# EAGLE design APM-PX-Adapter (EAGLE 7.4.0)
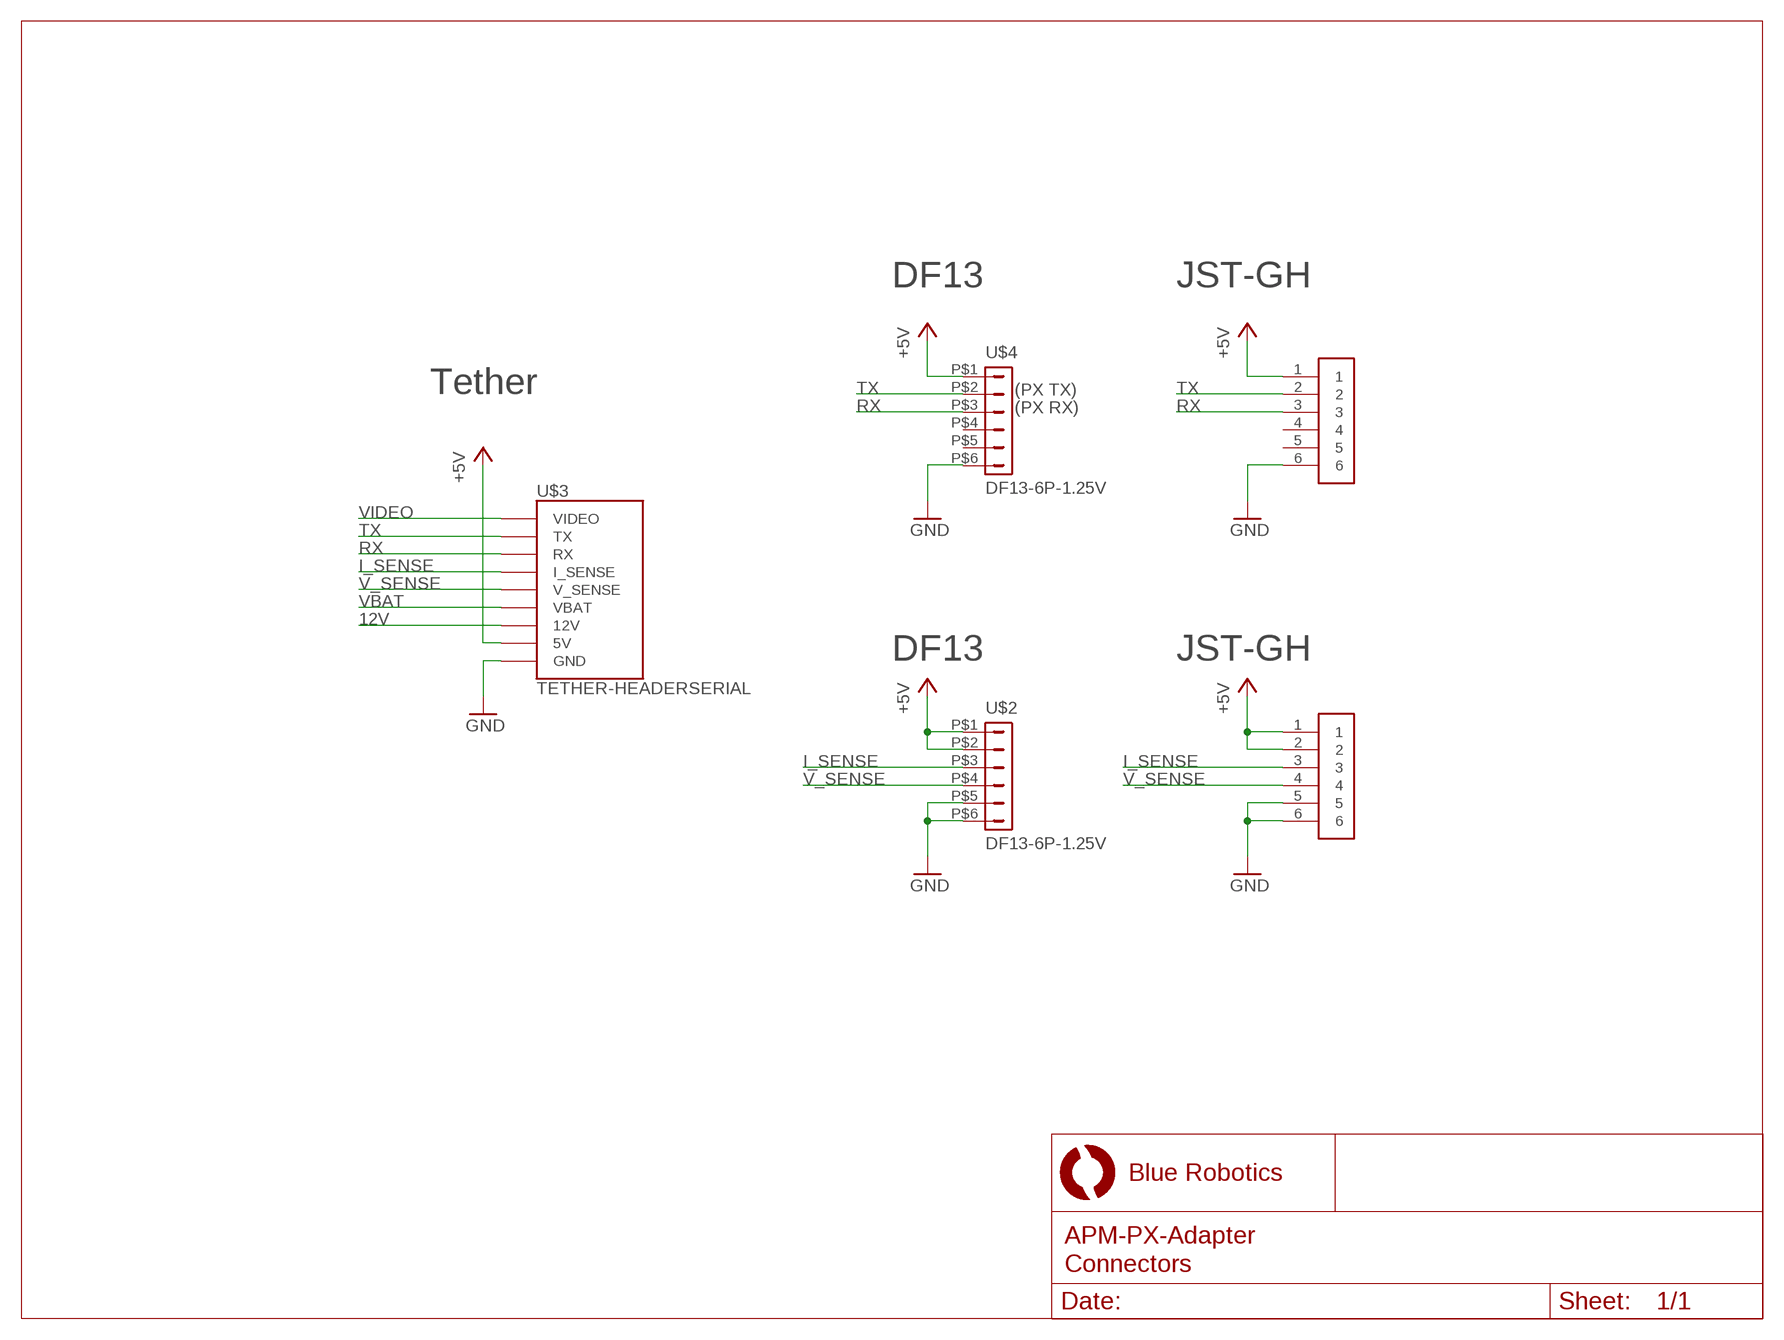
[diagram p0: schematic, sheet 1]

## Parts
U$1  JST-GH-6TOP-ENTRY  [JST-GH-TOP-6]
U$2  DF13-6P-1.25V  [DF13C-6P-1.25V]
U$3  TETHER-HEADERSERIAL  [TETHER-HEADER-2X7]
U$4  DF13-6P-1.25V  [DF13C-6P-1.25V]
U$5  JST-GH-6TOP-ENTRY  [JST-GH-TOP-6]

## Nets
12V: U$3.12V
+5V: U$1.1 U$2.P$1 U$2.P$2 U$3.5V U$4.P$1 U$5.1 U$5.2
GND: U$1.6 U$2.P$5 U$2.P$6 U$3.GND0(GND) U$3.GND1(GND) U$3.GND2(GND) U$4.P$6 U$5.5 U$5.6
I_SENSE: U$2.P$3 U$3.I_SENSE U$5.3
RX: U$1.3 U$3.RX U$4.P$3
TX: U$1.2 U$3.TX U$4.P$2
V_SENSE: U$2.P$4 U$3.V_SENSE U$5.4
VBAT: U$3.VBAT
VIDEO: U$3.VIDEO
Unconnected: U$1.4 U$1.5 U$4.P$4 U$4.P$5

## Notes on the sheet
- DF13 | JST-GH
- Tether | (PX TX)
- (PX RX)
- DF13 | JST-GH

## Library data of the parts
U$1 U$5 = BlueRobotics-JST-GH:JST-GH-6
U$2 U$4 = con-hirose-df13:DF13-6P-1.25: DF13-6P 1.25mm Pitch Miniature Crimping Connector.
U$3 = BlueRobotics-Main:TETHER-HEADER

## Board
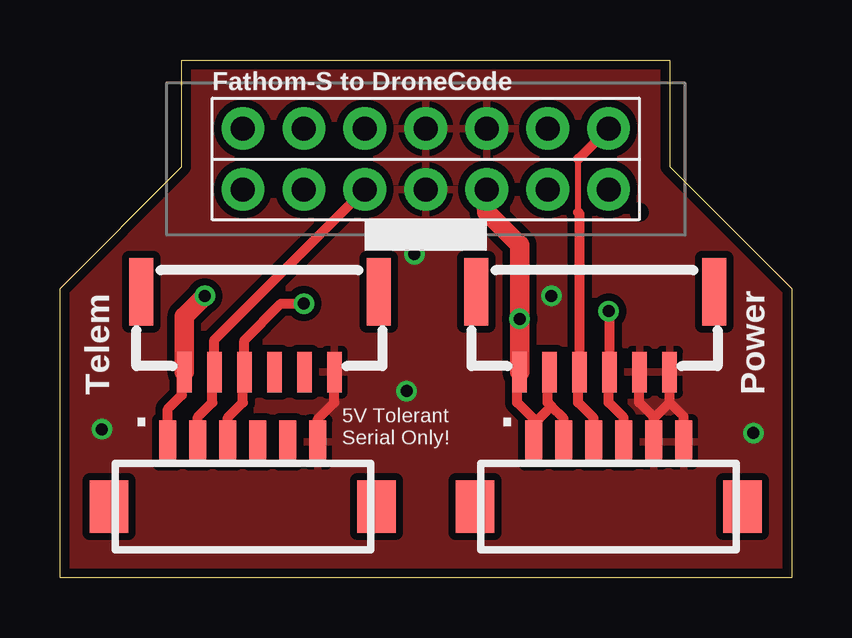
[diagram p1: board, top side]
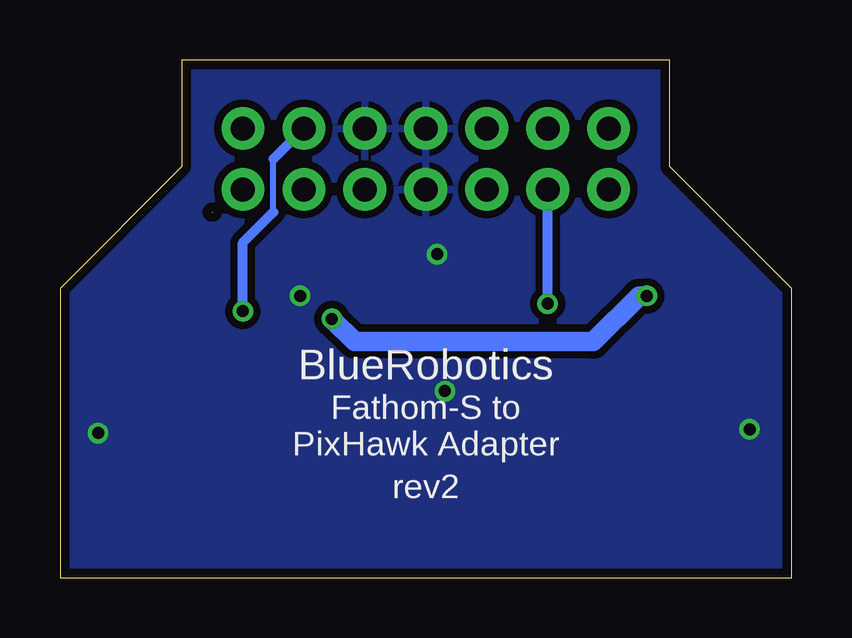
[diagram p2: board, bottom side, seen from below]

Size 30.48 x 21.59 mm. Coordinates in mm from the lower left corner, seen from the top.
Outline: 24.13,15.25 arc45 24.14,15.23
Outline: 0,0 0,12.06 5.08,17.14 5.08,21.59 25.4,21.59 25.4,17.14 30.48,12.06 30.48,0 0,0
Copper layers (1*16): Top 0.0356mm / dielectric 1.5011mm / Bottom 0.0356mm
Design rules "OSHPark *": minimum track width 6mil, minimum drill 13mil, track to track 6mil, track to pad 6mil, pad to pad 6mil, via to via 6mil, smd to smd 6mil, copper to edge 15mil, drill to drill 6mil, minimum pad ring 7mil, minimum via ring 7mil, stop-mask expansion 3mil, vias tented up to drill 30mil, thermal gap 10mil

### Footprints (pad centres in the part's own frame; a part is rotated, then mirrored left to right if it is on the bottom)
JST-GH-TOP-6 = smd 0.6 x 1.7: 1 6.25,0; 2 5,0; 3 3.75,0; 4 2.5,0; 5 1.25,0; 6 0,0 | smd 1 x 2.8: MECH1 8.05,-3.35; MECH2 -1.85,-3.35
DF13C-6P-1.25V = smd 1.6 x 2.2: M$0 5.575,-1.8; M$1 -5.575,-1.8 | smd 0.7 x 1.8: P$1 -3.125,0.9; P$2 -1.875,0.9; P$3 -0.625,0.9; P$4 0.625,0.9; P$5 1.875,0.9; P$6 3.125,0.9
TETHER-HEADER-2X7 = drill 1 pad 1.778: 5V 10.16,0; 12V 12.7,0; GND0 7.62,0; GND1 7.62,2.54; GND2 10.16,2.54; I_SENSE 15.24,2.54; NC0 0,2.54; NC1 2.54,2.54; NC2 5.08,2.54; RX 2.54,0; TX 5.08,0; V_SENSE 12.7,2.54; VBAT 15.24,0; VIDEO 0,0

### Placement (x,y rotation side)
U$1  11.43,8.57 180 top
U$2  22.86,4.76 0 top
U$3  7.62,16.19 0 top
U$4  7.62,4.76 0 top
U$5  25.4,8.57 180 top

### Tracks (layer width: path | path; a pad name or v marks a point on that pad's centre or on a via)
+5V  (via drill 0.5)
  Top 0.406: U$4.P$1 4.5,7.04 5.08,7.62 5.08,8.47 U$1.1 | U$2.P$2 20.98,6.64 20.48,7.14 | 20.48,7.14 20.32,7.3 20.32,8.49 U$5.2 | U$2.P$1 19.73,6.62 | 19.73,6.62 19.05,7.3 19.05,8.47 U$5.1 | 19.73,6.62 19.95,6.62 20.48,7.14
  Top 0.813: U$5.1 v19.15,10.79 19.15,11.11 19.15,13.87 17.78,15.24 U$3.5V | U$1.1 5.18,10.89 v6.03,11.75
  Bottom 0.813: v6.03,11.75 6.35,11.75 8.26,9.84 18.2,9.84 v19.15,10.79
GND  (via drill 0.5)
  Top 0.406: U$4.P$6 10.74,6.62 11.43,7.3 U$1.6 | U$2.P$6 25.98,6.72 25.4,7.3 | 25.4,7.3 U$5.6 | U$2.P$5 24.73,6.7 | 24.73,6.7 24.13,7.3 24.13,8.55 U$5.5 | 24.73,6.7 24.8,6.7 25.4,7.3
  other vias: 20.48,11.75 14.76,13.49 14.45,7.78 1.75,6.19 28.89,6.03
  pour Bottom (isolate 0.305): 0,0 30.48,0 30.48,22.86 0,22.86
  pour Top (isolate 0.305): -1.27,-1.27 31.75,-1.27 31.75,21.59 -1.27,21.59
I_SENSE
  Top 0.254: 21.59,15.24 21.59,17.46
  Top 0.406: U$2.P$3 22.23,6.66 21.59,7.3 21.59,8.51 U$5.3 21.65,15.18 21.59,15.24 | 21.59,17.46 U$3.I_SENSE
RX  (via drill 0.5)
  Top 0.406: U$4.P$3 7,6.68 7.62,7.3 7.62,8.51 U$1.3 7.68,9.9 9.21,11.43 v10.16,11.43
  Bottom 0.406: v10.16,11.43 U$3.RX
TX
  Top 0.406: U$4.P$2 5.75,6.7 6.35,7.3 6.35,8.49 U$1.2 6.43,9.92 U$3.TX
V_SENSE  (via drill 0.5)
  Top 0.406: U$2.P$4 23.48,6.68 22.86,7.3 22.86,8.53 U$5.4 22.9,11.07 v22.86,11.11
  Bottom 0.254: 21.59,15.24 21.59,17.46
  Bottom 0.406: v22.86,11.11 22.86,13.97 21.59,15.24 | 21.59,17.46 U$3.V_SENSE

### Text on the board
tPlace: Fathom-S to DroneCode | Telem | Power | 5V Tolerant / Serial Only!
bPlace: BlueRobotics | Fathom-S to / PixHawk Adapter | rev2